# EAGLE design Driver (EAGLE 7.2.0)
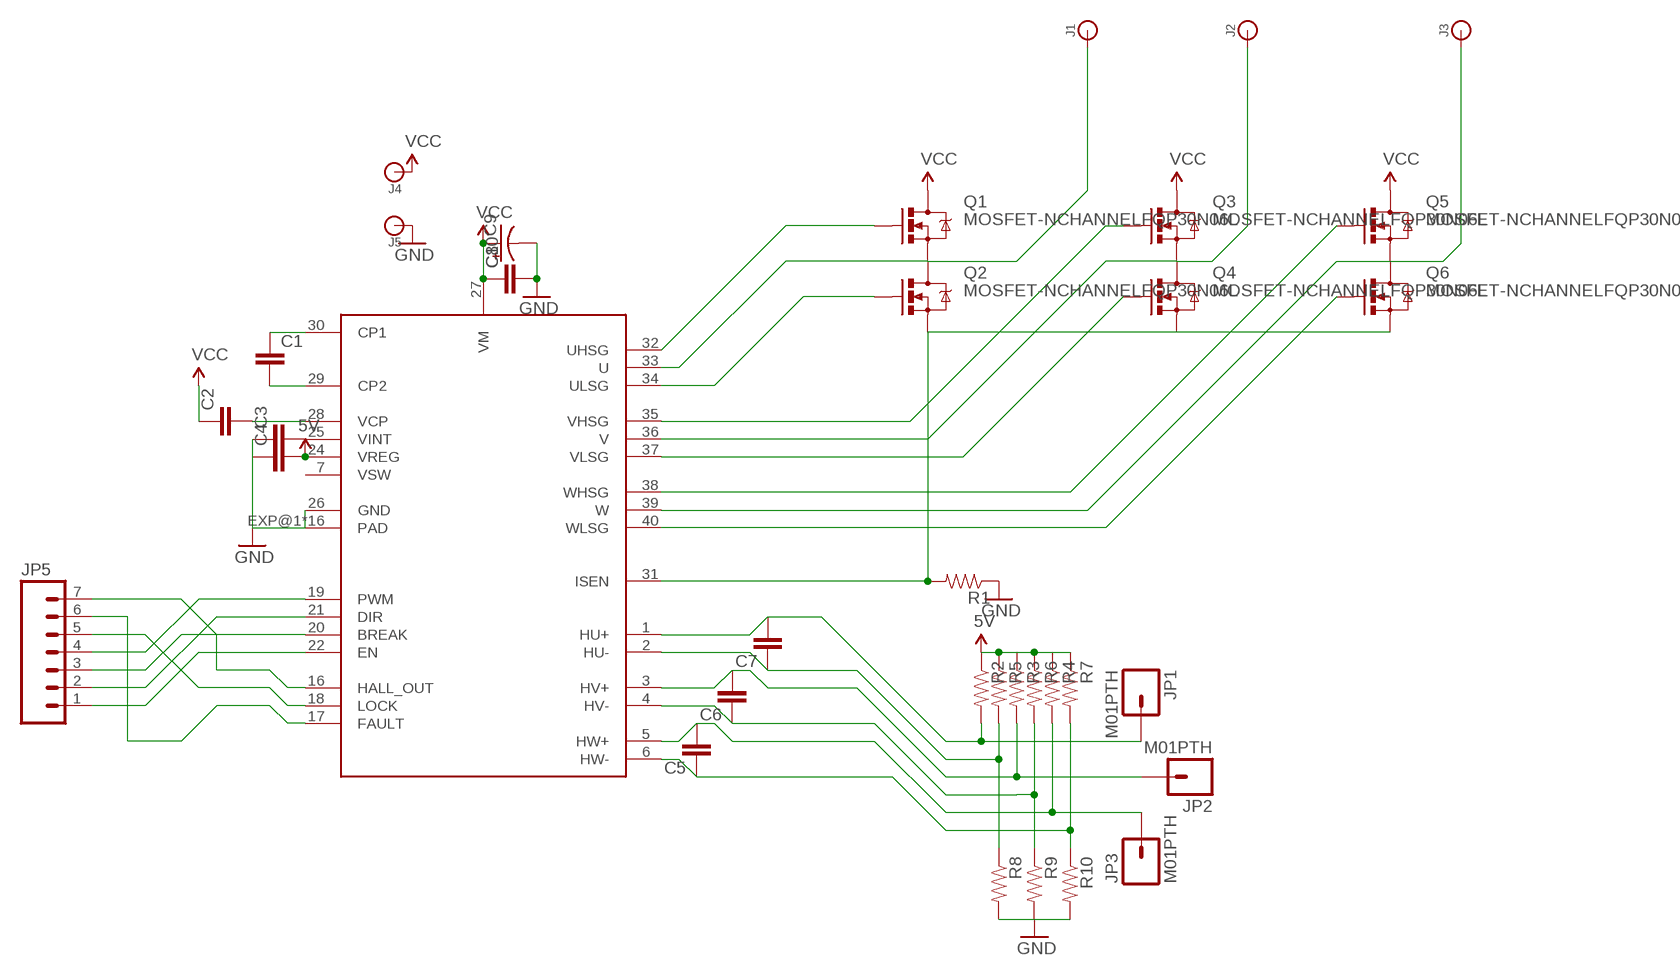
[diagram p0: schematic, sheet 1]

## Parts
C1  CAP1206  [1206]
C2  CAP1206  [1206]
C3  CAP1206  [1206]
C4  CAP1206  [1206]
C5  CAP0805  [0805]
C6  CAP0805  [0805]
C7  CAP0805  [0805]
C8  CAP1206  [1206]
C9  CAP_POLPTH4  [CPOL-RADIAL-1000UF-25V]
C10  CAP0805  [0805]
J1  BANANA_CONN  [BANANA_CONN]
J2  BANANA_CONN  [BANANA_CONN]
J3  BANANA_CONN  [BANANA_CONN]
J4  BANANA_CONN  [BANANA_CONN]
J5  BANANA_CONN  [BANANA_CONN]
JP1  M01PTH  [1X01]
JP2  M01PTH  [1X01]
JP3  M01PTH  [1X01]
JP5  M07  [1X07]
Q1  MOSFET-NCHANNELFQP30N06L  [TO220V]
Q2  MOSFET-NCHANNELFQP30N06L  [TO220V]
Q3  MOSFET-NCHANNELFQP30N06L  [TO220V]
Q4  MOSFET-NCHANNELFQP30N06L  [TO220V]
Q5  MOSFET-NCHANNELFQP30N06L  [TO220V]
Q6  MOSFET-NCHANNELFQP30N06L  [TO220V]
R1  RESISTOR2010  [R2010]
R2  RESISTOR0805-RES  [0805]
R3  RESISTOR0805-RES  [0805]
R4  RESISTOR0805-RES  [0805]
R5  RESISTOR0805-RES  [0805]
R6  RESISTOR0805-RES  [0805]
R7  RESISTOR0805-RES  [0805]
R8  RESISTOR0805-RES  [0805]
R9  RESISTOR0805-RES  [0805]
R10  RESISTOR0805-RES  [0805]
U$1  DRV8307  [QFN40-6X6]

## Nets
5V: C4.2 R2.1 R3.1 R4.1 R5.1 R6.1 R7.1 U$1.24(VREG)
GND: C3.1 C4.1 C8.2 C9.- C10.2 J5.P$1 R1.1 R8.2 R9.2 R10.2 U$1.26(GND) U$1.EXP@1(PAD) U$1.EXP@2(PAD) U$1.EXP@3(PAD) U$1.EXP@4(PAD) U$1.EXP@5(PAD) U$1.EXP@6(PAD) U$1.EXP@7(PAD) U$1.EXP@8(PAD) U$1.EXP@9(PAD) U$1.EXP@10(PAD) U$1.EXP@11(PAD) U$1.EXP@12(PAD) U$1.EXP@13(PAD) U$1.EXP@14(PAD) U$1.EXP@15(PAD) U$1.EXP@16(PAD)
N$1: C1.1 U$1.30(CP1)
N$2: C1.2 U$1.29(CP2)
N$3: C2.2 U$1.28(VCP)
N$4: C3.2 U$1.25(VINT)
N$5: JP5.4 U$1.19(PWM)
N$6: Q2.1(G) U$1.34(ULSG)
N$7: J1.P$1 Q1.3(S) Q2.2(D) U$1.33(U)
N$8: J2.P$1 Q3.3(S) Q4.2(D) U$1.36(V)
N$9: J3.P$1 Q5.3(S) Q6.2(D) U$1.39(W)
N$10: Q1.1(G) U$1.32(UHSG)
N$11: Q3.1(G) U$1.35(VHSG)
N$12: Q4.1(G) U$1.37(VLSG)
N$13: Q5.1(G) U$1.38(WHSG)
N$14: Q2.3(S) Q4.3(S) Q6.3(S) R1.2 U$1.31(ISEN)
N$15: Q6.1(G) U$1.40(WLSG)
N$16: C5.2 JP3.1 R4.2 U$1.5(HW+)
N$17: C5.1 R7.2 R10.1 U$1.6(HW-)
N$18: C6.2 JP2.1 R3.2 U$1.3(HV+)
N$19: C6.1 R6.2 R9.1 U$1.4(HV-)
N$20: C7.2 JP1.1 R2.2 U$1.1(HU+)
N$21: C7.1 R5.2 R8.1 U$1.2(HU-)
N$22: JP5.2 U$1.21(DIR)
N$23: JP5.3 U$1.20(BREAK)
N$24: JP5.1 U$1.22(EN)
N$25: JP5.7 U$1.16(HALL_OUT)
N$26: JP5.5 U$1.18(LOCK)
N$27: JP5.6 U$1.17(FAULT)
VCC: C2.1 C8.1 C9.+ C10.1 J4.P$1 Q1.2(D) Q3.2(D) Q5.2(D) U$1.27(VM)
Unconnected: U$1.7(VSW)

## Library data of the parts
C1-C8 C10 = SparkFun-Capacitors:CAP: Capacitor Standard 0603 ceramic capacitor, and 0.1" leaded capacitor.
C9 = SparkFun-Capacitors:CAP_POL: Capacitor Polarized These are standard SMD and PTH capacitors. Normally 10uF, 47uF, and 100uF in electrolytic and tantalum varieties. Always verify the external diameter of the through hole cap, it varies with capacity, voltage, and manufacturer. The EIA devices should be standard.
J1-J5 = SparkFun-Connectors:BANANA_CONN: Through-hole banana jack
JP1-JP3 = SparkFun-Connectors:M01: Header 1 Standard 1-pin 0.1" header. Use with straight break away headers (SKU : PRT-00116), right angle break away headers (PRT-00553), swiss pins (PRT-00743), machine pins (PRT-00117), and female headers (PRT-00115).
JP5 = SparkFun-Connectors:M07: Header 7 Standard 7-pin 0.1" header. Use with straight break away headers (SKU : PRT-00116), right angle break away headers (PRT-00553), swiss pins (PRT-00743), machine pins (PRT-00117), and female headers (PRT-00115). NOTES ON THE VARIANTS LOCK and LOCK_LONGPADS... This footprint was designed to help hold the alignment of a through-hole component (i.e. 7-pin header) while soldering it into place. You may notice that each hole has been shifted either up or down by 0.005 of an inch from it's more standard position (which is usually a perfectly straight line). This slight alteration caused the pins (the squares in the middle) to touch the edges of the holes. Because they are alternating, it causes a "brace" to hold the header in place. 0.005 has proven to be the perfect amount of "off-center" position when using our standard breakaway headers. Although looks a little odd when you look at the bare footprint, once you have a header in there, the alteration is very hard to notice. Also, if you push a header all the way into place, it is covered up entirely on the bottom side. This idea of altering the position of holes to aid alignment will be further integrated into the Sparkfun Library for other footprints. It can help hold any component with 3 or more connection pins.
Q1-Q6 = SparkFun-DiscreteSemi:MOSFET-NCHANNEL: Common NMOSFET Parts MFG P/N Store ID Prod ID FDD8780 TRANS-09984 SI7820DN TRANS-11055 FDS6630A IC-08089 2N7002PW TRANS-11151 FQP30N06L COM-10213 TRANS-10060 BSS123LT1G TRANS-08345 BSS138 TRANS-00830 BS170 2N7000; PROD_ID: TRANS-10060
R1-R10 = SparkFun-Resistors:RESISTOR: Resistor Basic schematic elements and footprints for 0603, 1206, and PTH resistors.
U$1 = texas:DRV8307

## Board
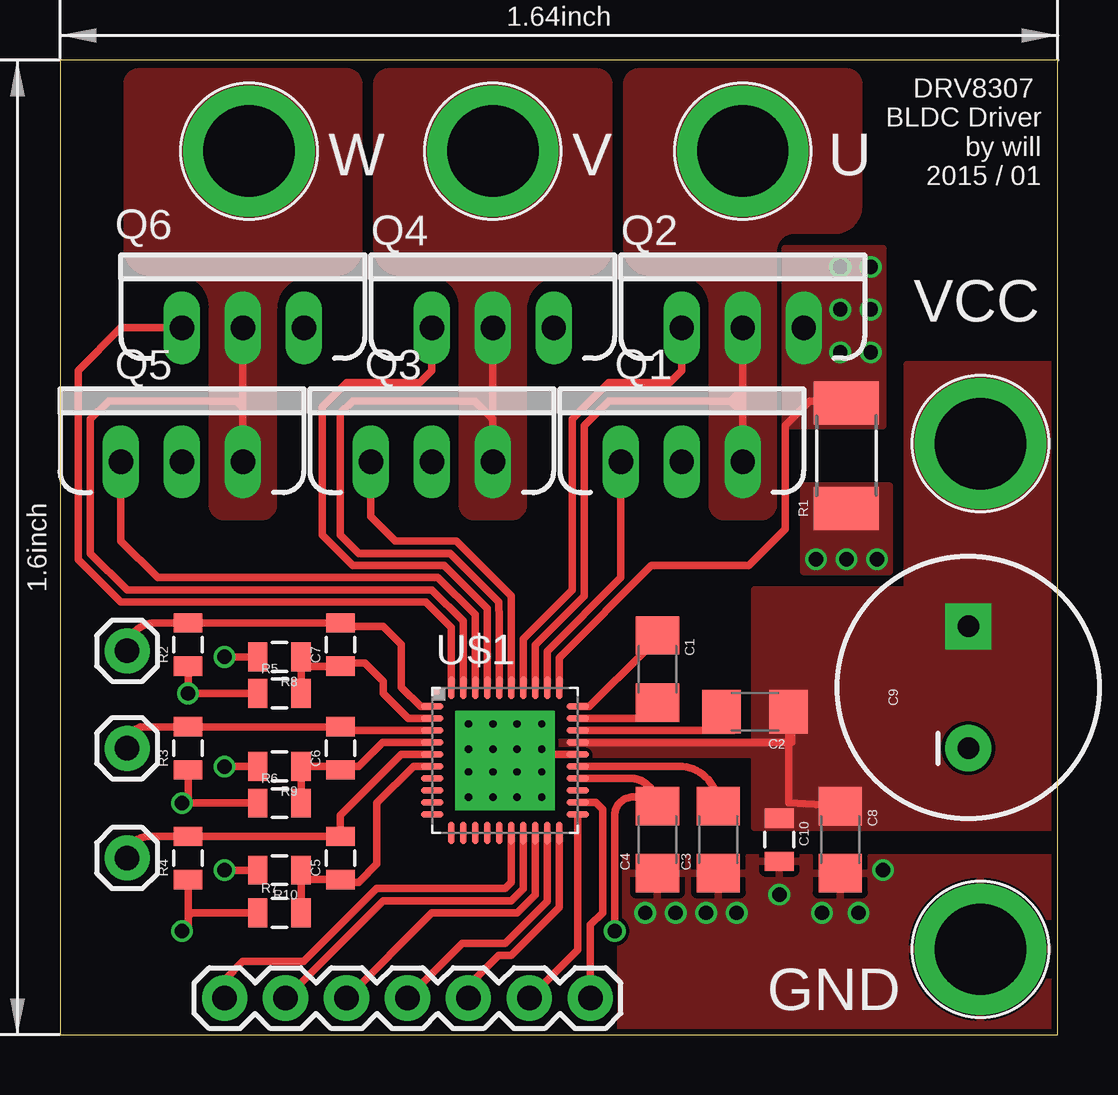
[diagram p1: board, top side]
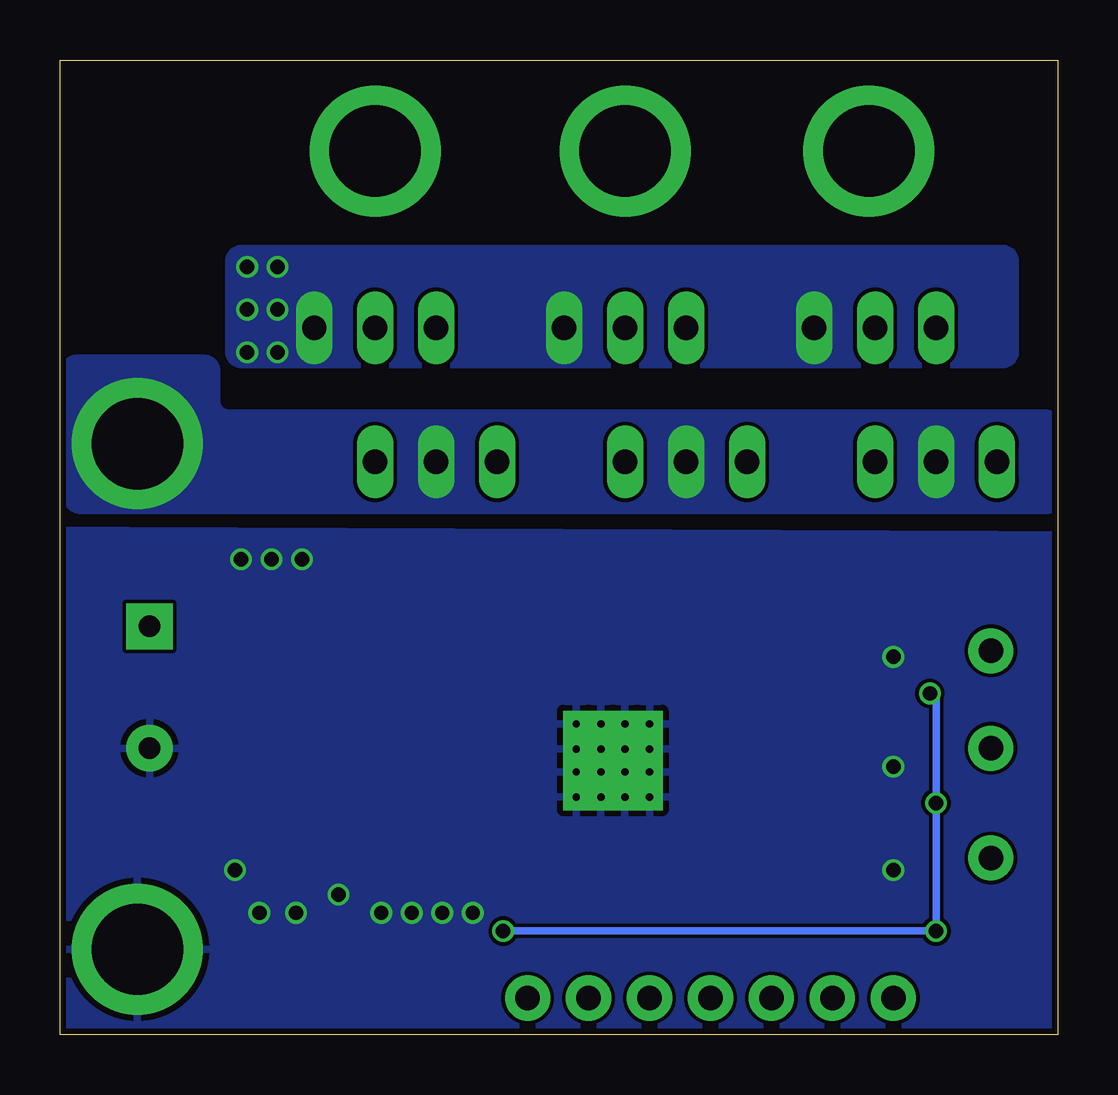
[diagram p2: board, bottom side, seen from below]

Size 41.58 x 40.63 mm. Coordinates in mm from the lower left corner, seen from the top.
Outline: 0,0 41.58,0 41.58,40.63 0,40.63 0,0
Copper layers (1*16): Top 0.035mm / dielectric 1.5mm / Bottom 0.035mm
Design rules "SeeedStudio_2layer_DRU_no_angle_20140221": minimum track width 6mil, minimum drill 12mil, track to track 6mil, track to pad 6mil, pad to pad 6mil, via to via 6mil, smd to smd 0mil, copper to edge 10mil, drill to drill 10mil, minimum pad ring 10mil, minimum via ring 6mil, stop-mask expansion 2mil, vias tented up to drill 100mil, thermal gap 10mil

### Footprints (pad centres in the part's own frame; a part is rotated, then mirrored left to right if it is on the bottom)
1206 = smd 1.6 x 1.8: 1 -1.4,0; 2 1.4,0
0805 = smd 0.8 x 1.2: 1 -0.9,0; 2 0.9,0
CPOL-RADIAL-1000UF-25V = drill 0.9 pad 1.93 square: + 2.54,0 | drill 0.9 pad 1.93: - -2.54,0
BANANA_CONN = drill 3.81 pad 5.461: P$1 0,0
1X01 = drill 1.016 pad 1.88: 1 0,0
1X07 = drill 1.016 pad 1.88: 1 0,0; 2 2.54,0; 3 5.08,0; 4 7.62,0; 5 10.16,0; 6 12.7,0; 7 15.24,0
TO220V = drill 1.016 long: 1 -2.54,0; 2 0,0; 3 2.54,0
R2010 = smd 1.8 x 2.7: 1 -2.2,0; 2 2.2,0
QFN40-6X6 = smd 0.95 x 0.28: 1 -3.025,2.25; 2 -3.025,1.75; 3 -3.025,1.25; 4 -3.025,0.75; 5 -3.025,0.25; 6 -3.025,-0.25; 7 -3.025,-0.75; 8 -3.025,-1.25; 9 -3.025,-1.75; 10 -3.025,-2.25; 21 3.025,-2.25; 22 3.025,-1.75; 23 3.025,-1.25; 24 3.025,-0.75; 25 3.025,-0.25; 26 3.025,0.25; 27 3.025,0.75; 28 3.025,1.25; 29 3.025,1.75; 30 3.025,2.25 | smd 0.28 x 0.95: 11 -2.25,-3.025; 12 -1.75,-3.025; 13 -1.25,-3.025; 14 -0.75,-3.025; 15 -0.25,-3.025; 16 0.25,-3.025; 17 0.75,-3.025; 18 1.25,-3.025; 19 1.75,-3.025; 20 2.25,-3.025; 31 2.25,3.025; 32 1.75,3.025; 33 1.25,3.025; 34 0.75,3.025; 35 0.25,3.025; 36 -0.25,3.025; 37 -0.75,3.025; 38 -1.25,3.025; 39 -1.75,3.025; 40 -2.25,3.025 | drill 0.3 pad 1.1 square: EXP@1 -1.525,1.525; EXP@2 -0.5,1.525; EXP@3 0.5,1.525; EXP@4 1.525,1.525; EXP@5 -1.525,0.475; EXP@6 -0.5,0.475; EXP@7 0.5,0.475; EXP@8 1.525,0.475; EXP@9 -1.525,-0.475; EXP@10 -0.5,-0.475; EXP@11 0.5,-0.475; EXP@12 1.525,-0.475; EXP@13 -1.525,-1.525; EXP@14 -0.5,-1.525; EXP@15 0.5,-1.525; EXP@16 1.525,-1.525

### Placement (x,y rotation side)
C1  24.89,15.24 270 top
C2  28.96,13.46 180 top
C3  27.43,8.13 90 top
C4  24.89,8.13 90 top
C5  11.68,7.37 90 top
C6  11.68,11.94 90 top
C7  11.68,16.26 90 top
C8  32.51,8.13 270 top
C9  37.85,14.48 90 top
C10  29.97,8.13 270 top
J1  28.45,36.83 0 top
J2  18.03,36.83 0 top
J3  7.87,36.83 0 top
J4  38.35,24.64 0 top
J5  38.35,3.56 0 top
JP1  2.79,16 90 top
JP2  2.79,11.94 0 top
JP3  2.79,7.37 0 top
JP5  22.1,1.52 180 top
Q1  25.91,23.88 0 top
Q2  28.45,29.46 0 top
Q3  15.49,23.88 0 top
Q4  18.03,29.46 0 top
Q5  5.08,23.88 0 top
Q6  7.62,29.46 0 top
R1  32.77,24.13 90 top
R2  5.33,16.26 90 top
R3  5.33,11.94 90 top
R4  5.33,7.37 90 top
R5  9.14,14.22 0 top
R6  9.14,9.65 0 top
R7  9.14,5.08 0 top
R8  9.14,15.75 180 top
R9  9.14,11.18 180 top
R10  9.14,6.86 180 top
U$1  18.54,11.43 0 top

### Tracks (layer width: path | path; a pad name or v marks a point on that pad's centre or on a via)
5V  (via drill 0.6)
  Top 0.305: C4.2 arc90 23.74,10.68 U$1.24 23.86,10.68 arc-90 24.64,9.91 23.88,9.91 arc90 23.11,9.14 v23.11,4.32 | R2.1 5.33,14.48 arc-90 5.08,14.22 v5.33,14.22 R5.1 | R6.1 5.33,9.65 | 5.33,9.65 v5.08,9.65 | R3.1 5.33,9.65 | R4.1 5.33,4.83 | 5.33,4.83 5.33,4.57 arc-90 v5.08,4.32 | R7.1 5.59,5.08 arc90 5.33,4.83
  Bottom 0.305: 5.08,14.22 arc-90 v5.33,14.22 arc90 5.08,14.22 | 5.08,14.22 v5.08,9.65 v5.08,4.32 v23.11,4.32
GND  (via drill 0.6)
  Top 0.305: U$1.26 20.29,11.68 | 20.29,11.68 arc-90 U$1.EXP@8 U$1.EXP@4 | 20.29,11.68 20.29,11.18 arc-90 U$1.EXP@12 U$1.EXP@11 | U$1.EXP@16 U$1.EXP@15 | U$1.EXP@15 U$1.EXP@11 | U$1.EXP@11 U$1.EXP@7 | U$1.EXP@7 U$1.EXP@6 | U$1.EXP@6 U$1.EXP@10 | U$1.EXP@15 arc90 U$1.EXP@15 U$1.EXP@14 arc90 U$1.EXP@14 U$1.EXP@13 | U$1.EXP@9 U$1.EXP@5 U$1.EXP@6 | U$1.EXP@7 arc-90 18.04,12.91 U$1.EXP@2 U$1.EXP@1 | U$1.EXP@3 U$1.EXP@3 arc-90 U$1.EXP@3 U$1.EXP@7 arc-90 U$1.EXP@7 | R1.1 32.77,21.59 | C4.1 24.89,6.35 | R8.2 v6.86,15.75 | R9.2 v6.86,11.18 | R10.2 v6.86,6.86
  other vias: 31.5,19.81 34.04,19.81 24.38,5.08 25.65,5.08 26.92,5.08 28.19,5.08 31.75,5.08 33.27,5.08 29.97,5.84 32.77,19.81 34.29,6.86
  pour Bottom: -2.03,20.83 52.32,21.08 52.32,0.25 -1.78,0.25
  pour Top: 23.37,7.37 52.32,7.37 52.32,0.25 23.37,0.25
  pour Top (no thermals): 30.99,22.86 34.54,22.86 34.54,19.3 30.99,19.3
N$1
  Top 0.305: U$1.30 22.06,13.68 24.38,16 24.38,16.13 C1.1
N$2
  Top 0.305: C1.2 arc-90 24.23,13.18 U$1.29
N$3
  Top 0.305: U$1.28 28.04,12.68 arc90 C2.2
N$4
  Top 0.305: C3.2 arc90 25.78,11.18 U$1.25
N$5
  Top 0.305: U$1.19 20.29,5.56 18.54,3.81 16.76,3.81 JP5.4
N$6
  Top 0.305: U$1.34 19.29,16.5 21.34,18.54 21.34,25.65 22.86,27.18 25.4,27.18 25.91,27.69 Q2.1
N$7
  Top 0.305: U$1.33 19.79,16.24 21.84,18.29 21.84,25.4 22.86,26.42 27.94,26.42 | 27.94,26.42 28.19,26.42 | 28.19,26.42 28.45,26.16 | 28.45,26.16 28.45,25.91 | 28.45,25.91 Q1.3 | 28.19,26.42 28.45,26.42 | 28.45,26.42 28.45,26.16 | 28.45,26.42 28.45,26.67 | 28.45,26.92 28.45,27.18 Q2.2 | 28.45,26.92 28.45,26.67 | 28.45,26.67 28.19,26.42 | 28.19,26.42 28.19,26.67 | 28.19,26.67 28.45,26.92 | 28.19,26.67 27.94,26.42 | 27.94,26.42 28.45,25.91
  pour Top (no thermals): 27.18,30.23 27.18,22.1 arc90 27.69,21.59 29.21,21.59 arc90 29.72,22.1 29.72,32.77 arc-90 30.73,33.53 32.26,33.53 arc90 33.27,34.54 33.27,39.62 arc90 32.77,40.13 24.13,40.13 arc90 23.62,39.62 23.62,32.77 arc90 24.64,31.75 25.91,31.75 arc-90
N$8
  Top 0.305: 17.91,25.78 17.27,26.42 12.19,26.42 11.68,25.91 11.68,20.83 12.45,20.07 16.26,20.07 18.29,18.03 18.29,17.78 18.29,17.52 U$1.36 | 17.91,25.78 18.03,25.65 Q3.3 | Q4.2 18.03,25.91 17.91,25.78
  pour Top (no thermals): 16.76,30.23 16.76,22.1 arc90 17.27,21.59 18.8,21.59 arc90 19.3,22.1 19.3,30.23 arc-90 20.83,31.75 21.84,31.75 arc90 22.86,32.77 22.86,39.62 arc90 22.35,40.13 13.72,40.13 arc90 13.21,39.62 13.21,32.77 arc90 14.22,31.75 15.49,31.75 arc-90
N$9
  Top 0.305: U$1.39 16.79,17.24 15.49,18.54 2.79,18.54 1.27,20.07 1.27,25.65 2.03,26.42 7.37,26.42 | 7.37,26.42 7.62,26.16 | 7.62,26.16 Q5.3 | 7.37,26.42 7.62,26.42 | 7.62,26.16 7.62,26.42 | 7.62,26.42 Q6.2
  pour Top (no thermals): 6.35,30.23 6.35,22.1 arc90 6.86,21.59 8.38,21.59 arc90 8.89,22.1 8.89,30.23 arc-90 10.41,31.75 11.43,31.75 arc90 12.45,32.77 12.45,39.62 arc90 11.94,40.13 3.3,40.13 arc90 2.79,39.62 2.79,32.77 arc90 3.81,31.75 5.08,31.75 arc-90
N$10
  Top 0.305: U$1.32 20.29,15.97 23.37,19.05 Q1.1
N$11
  Top 0.305: Q3.1 12.95,21.59 13.97,20.57 16.51,20.57 18.8,18.29 18.79,18.28 U$1.35
N$12
  Top 0.305: Q4.1 15.49,27.69 14.99,27.18 11.94,27.18 10.92,26.16 10.92,20.83 12.19,19.56 16,19.56 17.79,17.77 U$1.37
N$13
  Top 0.305: U$1.38 17.29,17.51 15.75,19.05 4.06,19.05 2.54,20.57 Q5.1
N$14  (via drill 0.6)
  Top 0.305: U$1.31 20.79,15.71 24.64,19.56 28.7,19.56 30.23,21.08 30.23,25.4 31.24,26.42 32.68,26.42 R1.2
  other vias: 33.78,28.45 33.78,30.23 33.78,32 32.51,32 32.51,30.23 32.51,28.45
  pour Top (no thermals): 30.23,25.4 30.23,32.77 34.29,32.77 34.29,25.4
  pour Bottom (no thermals): 2.29,27.94 34.04,27.94 arc90 34.54,28.45 34.54,32.26 arc90 34.04,32.77 2.29,32.77 arc90 1.78,32.26 1.78,28.45 arc90
N$15
  Top 0.305: U$1.40 16.29,16.98 15.24,18.03 2.54,18.03 0.76,19.81 0.76,27.69 2.54,29.46 Q6.1
N$16
  Top 0.305: JP3.1 arc-90 3.69,8.27 R4.2 C5.2 11.68,9.14 14.22,11.68 U$1.5
N$17
  Top 0.305: R7.2 R10.1 arc90 10.44,6.47 C5.1 11.8,6.35 12.45,6.35 13.21,7.11 13.21,9.65 14.74,11.18 U$1.6
N$18
  Top 0.305: JP2.1 arc-90 3.44,12.84 R3.2 C6.2 11.84,12.68 U$1.3
N$19
  Top 0.305: R6.2 R9.1 11.55,11.18 C6.1 11.82,11.18 12.45,11.18 13.45,12.18 U$1.4
N$20
  Top 0.305: JP1.1 arc-90 3.95,17.16 R2.2 C7.2 11.82,17.02 13.46,17.02 14.22,16.26 14.22,14.48 15.02,13.68 U$1.1
N$21
  Top 0.305: R5.2 R8.1 10.44,15.36 C7.1 11.82,15.49 12.7,15.49 13.46,14.73 13.46,14.22 14.51,13.18 U$1.2
N$22
  Top 0.305: U$1.21 21.57,3.53 JP5.2
N$23
  Top 0.305: U$1.20 20.79,5.3 18.8,3.3 18.29,3.3 17.02,2.03 JP5.3
N$24
  Top 0.305: U$1.22 22.32,9.68 22.61,9.4 22.61,5.08 22.1,4.57 JP5.1
N$25
  Top 0.305: U$1.16 18.79,6.35 18.54,6.1 13.21,6.1 10.16,3.05 7.62,3.05 6.86,2.29 JP5.7
N$26
  Top 0.305: U$1.18 19.79,5.82 19.05,5.08 15.49,5.08 JP5.5
N$27
  Top 0.305: U$1.17 19.29,6.08 18.8,5.59 13.46,5.59 JP5.6
VCC
  Top 0.305: U$1.27 30.47,12.18 30.48,12.19 30.48,13.34 C2.1 30.36,9.65 C8.1
  pour Top (no thermals): 49.28,27.94 35.31,27.94 35.31,18.54 28.96,18.54 28.96,12.19 20.83,12.19 20.83,11.68 28.96,11.68 28.96,8.64 49.28,8.64
  pour Bottom (no thermals): 0.76,21.84 40.64,21.84 arc90 41.4,22.61 41.4,27.69 arc90 40.89,28.19 35.56,28.19 arc90 35.05,27.69 35.05,26.42 arc-90 34.54,25.91 0.51,25.91 arc90 0,25.4 0,22.35 arc90 0.51,21.84

### Text on the board
tNames: DRV8307 / BLDC Driver / by will / 2015 / 01 | W | V | U | VCC | GND